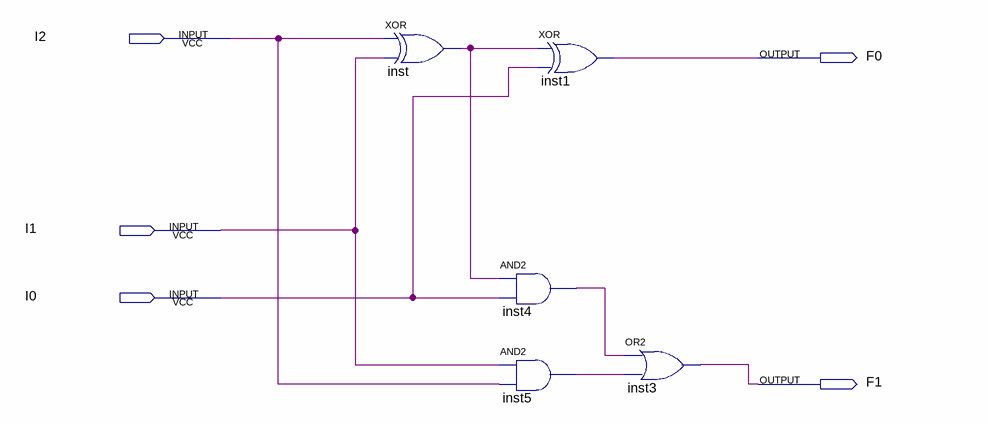
[diagram p0: schematic sheet]
// Quartus schematic full_adder.bdf as structural Verilog: 5 symbols, 5 pins
module full_adder (
  input  I2,
  input  I1,
  input  I0,
  output F0,
  output F1
);

  wire inst4_out, inst5_out, inst_out;

  xor inst (inst_out, I2, I1);
  and inst4 (inst4_out, inst_out, I0);
  and inst5 (inst5_out, I1, I2);
  xor inst1 (F0, inst_out, I0);
  or inst3 (F1, inst4_out, inst5_out);
endmodule
